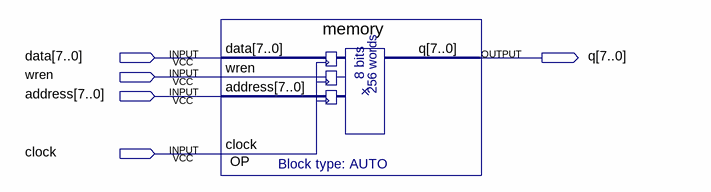
[diagram p0: schematic sheet]
// Quartus schematic proba.bdf as structural Verilog: 1 symbols, 5 pins
module proba (
  input  [7:0] data,
  input  wren,
  input  [7:0] address,
  input  clock,
  output [7:0] q
);

  memory OP (.data(data), .wren(wren), .address(address), .clock(clock), .q(q));
endmodule
